# EAGLE schematic Line Board (EAGLE 9.3.2)
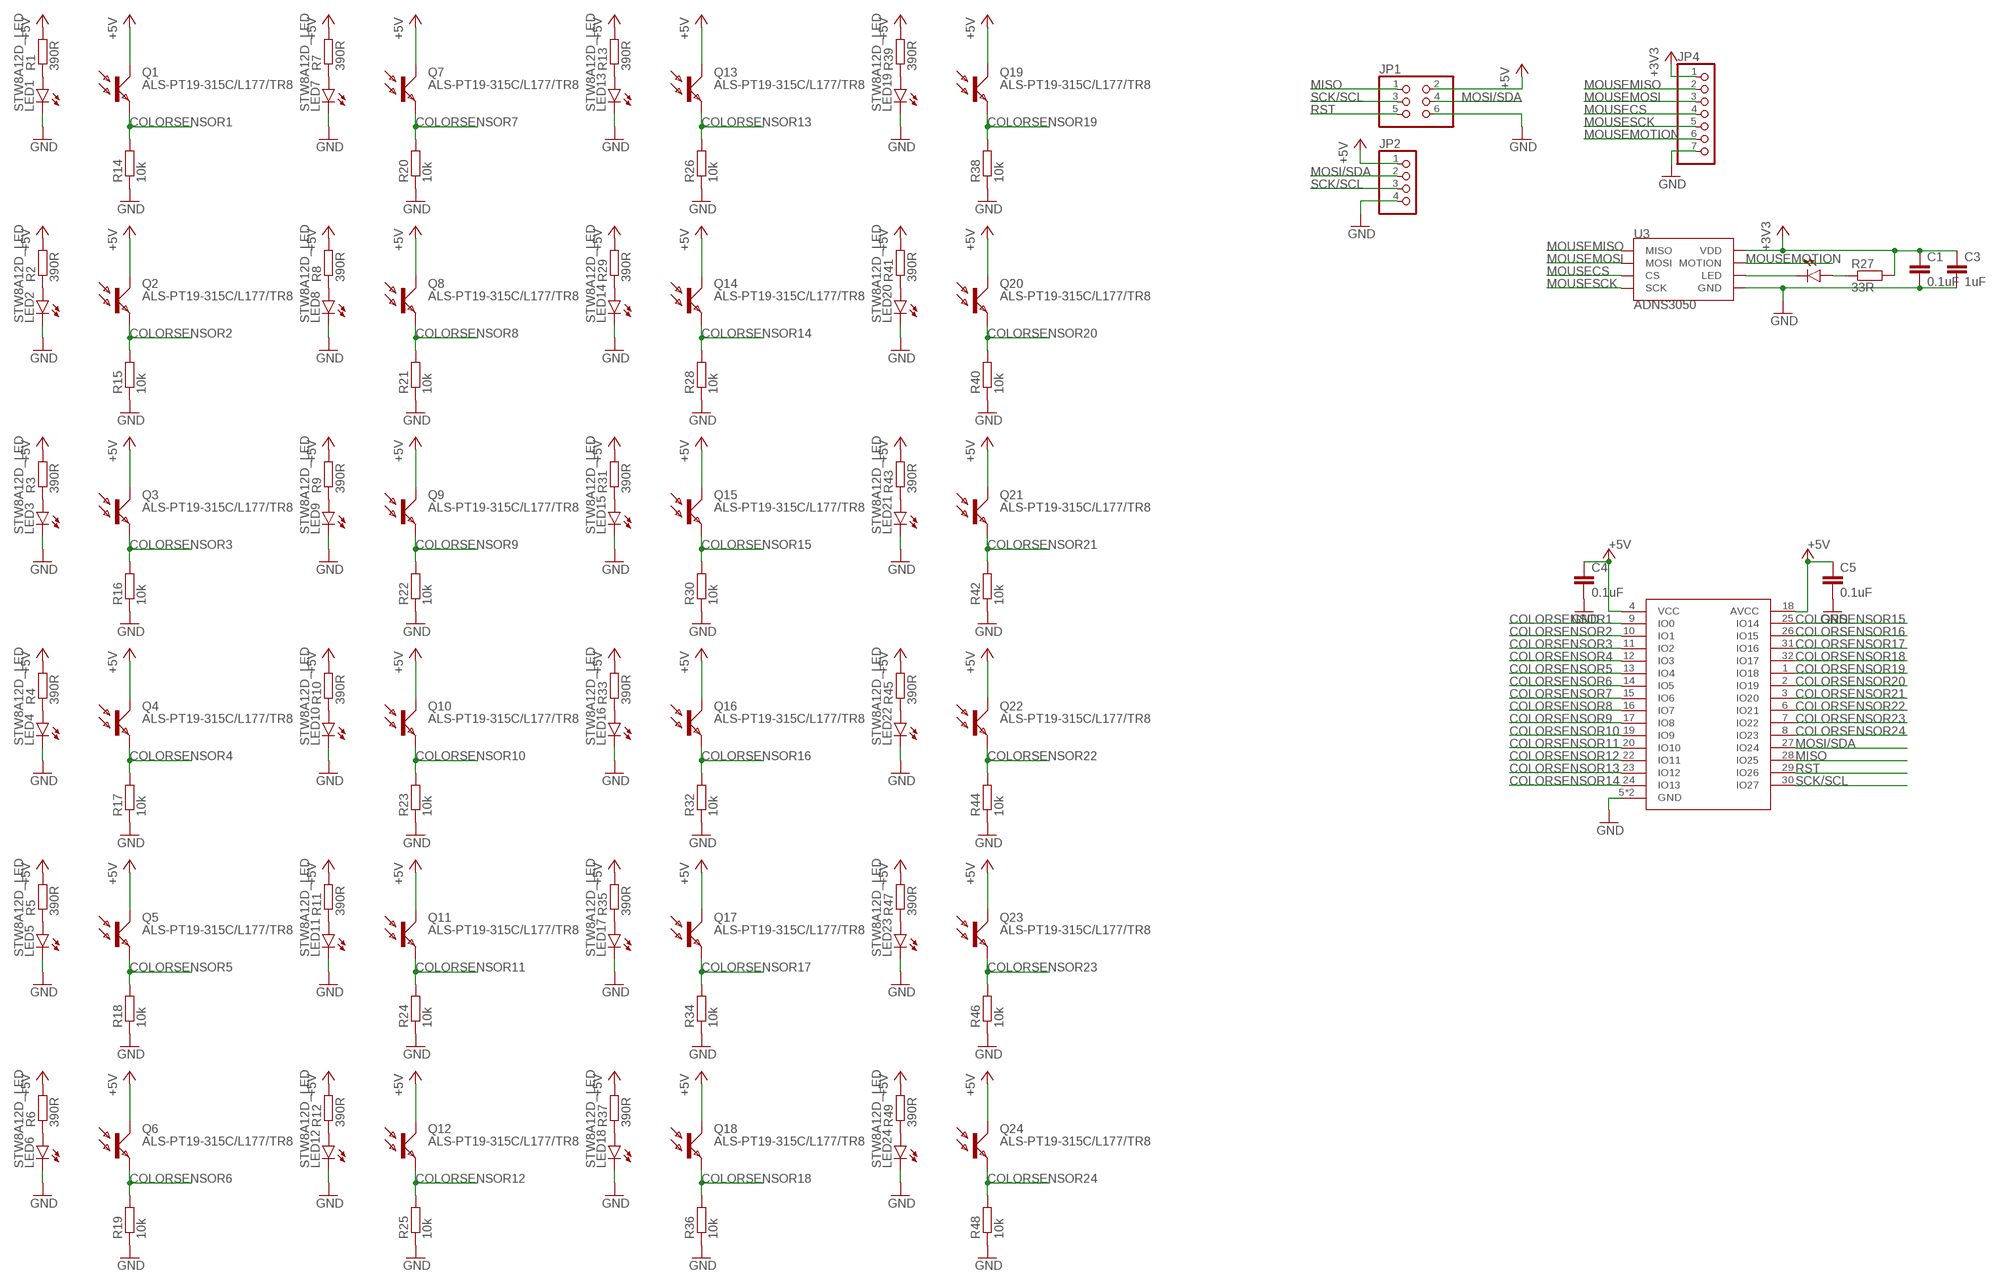
[diagram p0: schematic, sheet 1]

## Parts
C1  0.1uF  C-EUC0805  [C0805]
C3  1uF  C-EUC0805  [C0805]
C4  0.1uF  C-EUC0805  [C0805]
C5  0.1uF  C-EUC0805  [C0805]
JP1  PINHD-2X3  [2X03]
JP2  PINHD-1X4/90  [1X04/90]
JP4  PINHD-1X7  [1X07]
LED1  STW8A12D_LED  [LEDC3428X70]
LED2  STW8A12D_LED  [LEDC3428X70]
LED3  STW8A12D_LED  [LEDC3428X70]
LED4  STW8A12D_LED  [LEDC3428X70]
LED5  STW8A12D_LED  [LEDC3428X70]
LED6  STW8A12D_LED  [LEDC3428X70]
LED7  STW8A12D_LED  [LEDC3428X70]
LED8  STW8A12D_LED  [LEDC3428X70]
LED9  STW8A12D_LED  [LEDC3428X70]
LED10  STW8A12D_LED  [LEDC3428X70]
LED11  STW8A12D_LED  [LEDC3428X70]
LED12  STW8A12D_LED  [LEDC3428X70]
LED13  STW8A12D_LED  [LEDC3428X70]
LED14  STW8A12D_LED  [LEDC3428X70]
LED15  STW8A12D_LED  [LEDC3428X70]
LED16  STW8A12D_LED  [LEDC3428X70]
LED17  STW8A12D_LED  [LEDC3428X70]
LED18  STW8A12D_LED  [LEDC3428X70]
LED19  STW8A12D_LED  [LEDC3428X70]
LED20  STW8A12D_LED  [LEDC3428X70]
LED21  STW8A12D_LED  [LEDC3428X70]
LED22  STW8A12D_LED  [LEDC3428X70]
LED23  STW8A12D_LED  [LEDC3428X70]
LED24  STW8A12D_LED  [LEDC3428X70]
Q1  ALS-PT19-315C/L177/TR8  [LEDC1708X60]
Q2  ALS-PT19-315C/L177/TR8  [LEDC1708X60]
Q3  ALS-PT19-315C/L177/TR8  [LEDC1708X60]
Q4  ALS-PT19-315C/L177/TR8  [LEDC1708X60]
Q5  ALS-PT19-315C/L177/TR8  [LEDC1708X60]
Q6  ALS-PT19-315C/L177/TR8  [LEDC1708X60]
Q7  ALS-PT19-315C/L177/TR8  [LEDC1708X60]
Q8  ALS-PT19-315C/L177/TR8  [LEDC1708X60]
Q9  ALS-PT19-315C/L177/TR8  [LEDC1708X60]
Q10  ALS-PT19-315C/L177/TR8  [LEDC1708X60]
Q11  ALS-PT19-315C/L177/TR8  [LEDC1708X60]
Q12  ALS-PT19-315C/L177/TR8  [LEDC1708X60]
Q13  ALS-PT19-315C/L177/TR8  [LEDC1708X60]
Q14  ALS-PT19-315C/L177/TR8  [LEDC1708X60]
Q15  ALS-PT19-315C/L177/TR8  [LEDC1708X60]
Q16  ALS-PT19-315C/L177/TR8  [LEDC1708X60]
Q17  ALS-PT19-315C/L177/TR8  [LEDC1708X60]
Q18  ALS-PT19-315C/L177/TR8  [LEDC1708X60]
Q19  ALS-PT19-315C/L177/TR8  [LEDC1708X60]
Q20  ALS-PT19-315C/L177/TR8  [LEDC1708X60]
Q21  ALS-PT19-315C/L177/TR8  [LEDC1708X60]
Q22  ALS-PT19-315C/L177/TR8  [LEDC1708X60]
Q23  ALS-PT19-315C/L177/TR8  [LEDC1708X60]
Q24  ALS-PT19-315C/L177/TR8  [LEDC1708X60]
R1  390R  R-EU_R0805  [R0805]
R2  390R  R-EU_R0805  [R0805]
R3  390R  R-EU_R0805  [R0805]
R4  390R  R-EU_R0805  [R0805]
R5  390R  R-EU_R0805  [R0805]
R6  390R  R-EU_R0805  [R0805]
R7  390R  R-EU_R0805  [R0805]
R8  390R  R-EU_R0805  [R0805]
R9  390R  R-EU_R0805  [R0805]
R10  390R  R-EU_R0805  [R0805]
R11  390R  R-EU_R0805  [R0805]
R12  390R  R-EU_R0805  [R0805]
R13  390R  R-EU_R0805  [R0805]
R14  10k  R-EU_R0805  [R0805]
R15  10k  R-EU_R0805  [R0805]
R16  10k  R-EU_R0805  [R0805]
R17  10k  R-EU_R0805  [R0805]
R18  10k  R-EU_R0805  [R0805]
R19  10k  R-EU_R0805  [R0805]
R20  10k  R-EU_R0805  [R0805]
R21  10k  R-EU_R0805  [R0805]
R22  10k  R-EU_R0805  [R0805]
R23  10k  R-EU_R0805  [R0805]
R24  10k  R-EU_R0805  [R0805]
R25  10k  R-EU_R0805  [R0805]
R26  10k  R-EU_R0805  [R0805]
R27  33R  R-EU_R0805  [R0805]
R28  10k  R-EU_R0805  [R0805]
R29  390R  R-EU_R0805  [R0805]
R30  10k  R-EU_R0805  [R0805]
R31  390R  R-EU_R0805  [R0805]
R32  10k  R-EU_R0805  [R0805]
R33  390R  R-EU_R0805  [R0805]
R34  10k  R-EU_R0805  [R0805]
R35  390R  R-EU_R0805  [R0805]
R36  10k  R-EU_R0805  [R0805]
R37  390R  R-EU_R0805  [R0805]
R38  10k  R-EU_R0805  [R0805]
R39  390R  R-EU_R0805  [R0805]
R40  10k  R-EU_R0805  [R0805]
R41  390R  R-EU_R0805  [R0805]
R42  10k  R-EU_R0805  [R0805]
R43  390R  R-EU_R0805  [R0805]
R44  10k  R-EU_R0805  [R0805]
R45  390R  R-EU_R0805  [R0805]
R46  10k  R-EU_R0805  [R0805]
R47  390R  R-EU_R0805  [R0805]
R48  10k  R-EU_R0805  [R0805]
R49  390R  R-EU_R0805  [R0805]
U2  ATTINY828  [QFP80P900X900X120-32]
U3  ADNS3050  [ADNS3050]

## Nets
+3V3: C1.1 C3.1 JP4.1 R27.2 U3.7(VDD)
+5V: C4.1 C5.1 JP1.2 JP2.1 Q1.C Q2.C Q3.C Q4.C Q5.C Q6.C Q7.C Q8.C Q9.C Q10.C Q11.C Q12.C Q13.C Q14.C Q15.C Q16.C Q17.C Q18.C Q19.C Q20.C Q21.C Q22.C Q23.C Q24.C R1.2 R2.2 R3.2 R4.2 R5.2 R6.2 R7.2 R8.2 R9.2 R10.2 R11.2 R12.2 R13.2 R29.2 R31.2 R33.2 R35.2 R37.2 R39.2 R41.2 R43.2 R45.2 R47.2 R49.2 U2.4(VCC) U2.18(AVCC)
COLORSENSOR1: Q1.E R14.2 U2.9(IO0)
COLORSENSOR2: Q2.E R15.2 U2.10(IO1)
COLORSENSOR3: Q3.E R16.2 U2.11(IO2)
COLORSENSOR4: Q4.E R17.2 U2.12(IO3)
COLORSENSOR5: Q5.E R18.2 U2.13(IO4)
COLORSENSOR6: Q6.E R19.2 U2.14(IO5)
COLORSENSOR7: Q7.E R20.2 U2.15(IO6)
COLORSENSOR8: Q8.E R21.2 U2.16(IO7)
COLORSENSOR9: Q9.E R22.2 U2.17(IO8)
COLORSENSOR10: Q10.E R23.2 U2.19(IO9)
COLORSENSOR11: Q11.E R24.2 U2.20(IO10)
COLORSENSOR12: Q12.E R25.2 U2.22(IO11)
COLORSENSOR13: Q13.E R26.2 U2.23(IO12)
COLORSENSOR14: Q14.E R28.2 U2.24(IO13)
COLORSENSOR15: Q15.E R30.2 U2.25(IO14)
COLORSENSOR16: Q16.E R32.2 U2.26(IO15)
COLORSENSOR17: Q17.E R34.2 U2.31(IO16)
COLORSENSOR18: Q18.E R36.2 U2.32(IO17)
COLORSENSOR19: Q19.E R38.2 U2.1(IO18)
COLORSENSOR20: Q20.E R40.2 U2.2(IO19)
COLORSENSOR21: Q21.E R42.2 U2.3(IO20)
COLORSENSOR22: Q22.E R44.2 U2.6(IO21)
COLORSENSOR23: Q23.E R46.2 U2.7(IO22)
COLORSENSOR24: Q24.E R48.2 U2.8(IO23)
GND: C1.2 C3.2 C4.2 C5.2 JP1.6 JP2.4 JP4.7 LED1.2(C) LED2.2(C) LED3.2(C) LED4.2(C) LED5.2(C) LED6.2(C) LED7.2(C) LED8.2(C) LED9.2(C) LED10.2(C) LED11.2(C) LED12.2(C) LED13.2(C) LED14.2(C) LED15.2(C) LED16.2(C) LED17.2(C) LED18.2(C) LED19.2(C) LED20.2(C) LED21.2(C) LED22.2(C) LED23.2(C) LED24.2(C) R14.1 R15.1 R16.1 R17.1 R18.1 R19.1 R20.1 R21.1 R22.1 R23.1 R24.1 R25.1 R26.1 R28.1 R30.1 R32.1 R34.1 R36.1 R38.1 R40.1 R42.1 R44.1 R46.1 R48.1 U2.5(GND) U2.21(GND) U3.6(GND)
MISO: JP1.1 U2.28(IO25)
MOSI/SDA: JP1.4 JP2.2 U2.27(IO24)
MOUSECS: JP4.4 U3.4(CS)
MOUSEMISO: JP4.2 U3.1(MISO)
MOUSEMOSI: JP4.3 U3.3(MOSI)
MOUSEMOTION: JP4.6 U3.8(MOTION)
MOUSESCK: JP4.5 U3.5(SCK)
N$1: LED1.1(A) R1.1
N$2: U3.2(LED) U3.K
N$3: R27.1 U3.A
N$6: LED2.1(A) R2.1
N$8: LED3.1(A) R3.1
N$9: LED4.1(A) R4.1
N$10: LED5.1(A) R5.1
N$11: LED6.1(A) R6.1
N$12: LED7.1(A) R7.1
N$13: LED8.1(A) R8.1
N$14: LED9.1(A) R9.1
N$15: LED10.1(A) R10.1
N$16: LED11.1(A) R11.1
N$17: LED12.1(A) R12.1
N$18: LED13.1(A) R13.1
N$19: LED14.1(A) R29.1
N$20: LED15.1(A) R31.1
N$21: LED16.1(A) R33.1
N$22: LED17.1(A) R35.1
N$23: LED18.1(A) R37.1
N$24: LED19.1(A) R39.1
N$25: LED20.1(A) R41.1
N$26: LED21.1(A) R43.1
N$27: LED22.1(A) R45.1
N$28: LED23.1(A) R47.1
N$29: LED24.1(A) R49.1
RST: JP1.5 U2.29(IO26)
SCK/SCL: JP1.3 JP2.3 U2.30(IO27)

## Library data of the parts
C1 C3-C5 = rcl:C-EU: CAPACITOR, European symbol; SPICEPREFIX: C
JP1 = pinhead:PINHD-2X3: PIN HEADER
JP2 = pinhead:PINHD-1X4: PIN HEADER
JP4 = pinhead:PINHD-1X7: PIN HEADER
LED1-LED24 = Robocup2019:STW8A12D_LED
Q1-Q24 = Robocup2019:ALS-PT19-315C/L177/TR8
R1-R49 = rcl:R-EU_: RESISTOR, European symbol; SPICEPREFIX: R
U2 = Robocup2019:ATTINY828
U3 = Robocup2019:ADNS3050

## Net classes
0 default: width 0.203 mm